# Altium schematic sheet Connectors.SchDoc
size A4; SheetNumber: 2; SheetTotal: 2
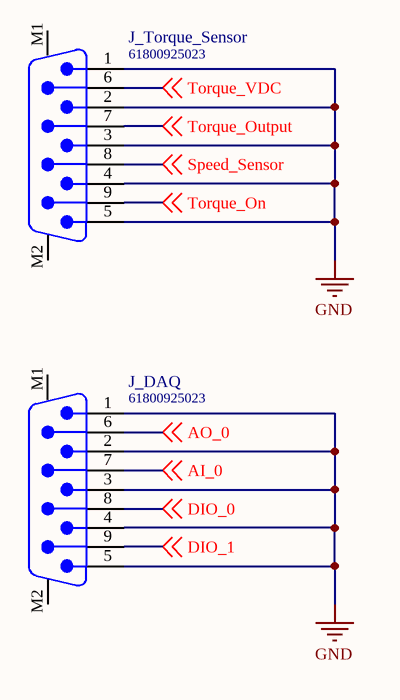
[diagram p0: Connectors.SchDoc]

## Parts
J_DAQ  61800925023  [61800925023]
J_Torque_Sensor  61800925023  [61800925023]

## Nets
GND: J_DAQ.1 J_DAQ.2 J_DAQ.3 J_DAQ.4 J_DAQ.5 J_Torque_Sensor.1 J_Torque_Sensor.2 J_Torque_Sensor.3 J_Torque_Sensor.4 J_Torque_Sensor.5
AI_0: J_DAQ.7 ; off-sheet AI_0
AO_0: J_DAQ.6 ; off-sheet AO_0
DIO_0: J_DAQ.8 ; off-sheet DIO_0
DIO_1: J_DAQ.9 ; off-sheet DIO_1
Speed_Sensor: J_Torque_Sensor.8 ; off-sheet Speed_Sensor
Torque_On: J_Torque_Sensor.9 ; off-sheet Torque_On
Torque_Output: J_Torque_Sensor.7 ; off-sheet Torque_Output
Torque_VDC: J_Torque_Sensor.6 ; off-sheet Torque_VDC

Not connected (* = marked no-connect by the designer): J_DAQ M1 M2; J_Torque_Sensor M1 M2

## Library data of the parts
J_DAQ J_Torque_Sensor = CMP-1502-00276-1: Male PCB Connector WR-DSUB, Vertical, 9 pins; Manufacturer: Wurth Elektronik; Rated Current: 3A; Working Voltage: 125VAC; Pin Number: 9; Contact Resistance: 30mOhm; Part Number: 61800925023; Gender: Male; Datasheet URL: https://katalog.we-online.de/em/datasheet/6180xx25023.pdf; Manufacturer URL: http://www.we-online.de; Package Reference: 61800925023; Mounting Technology: THT; Operating Temperature: -40to85degC; Orientation: Vertical; Packaging: Tray; Publisher: WurthElektronik